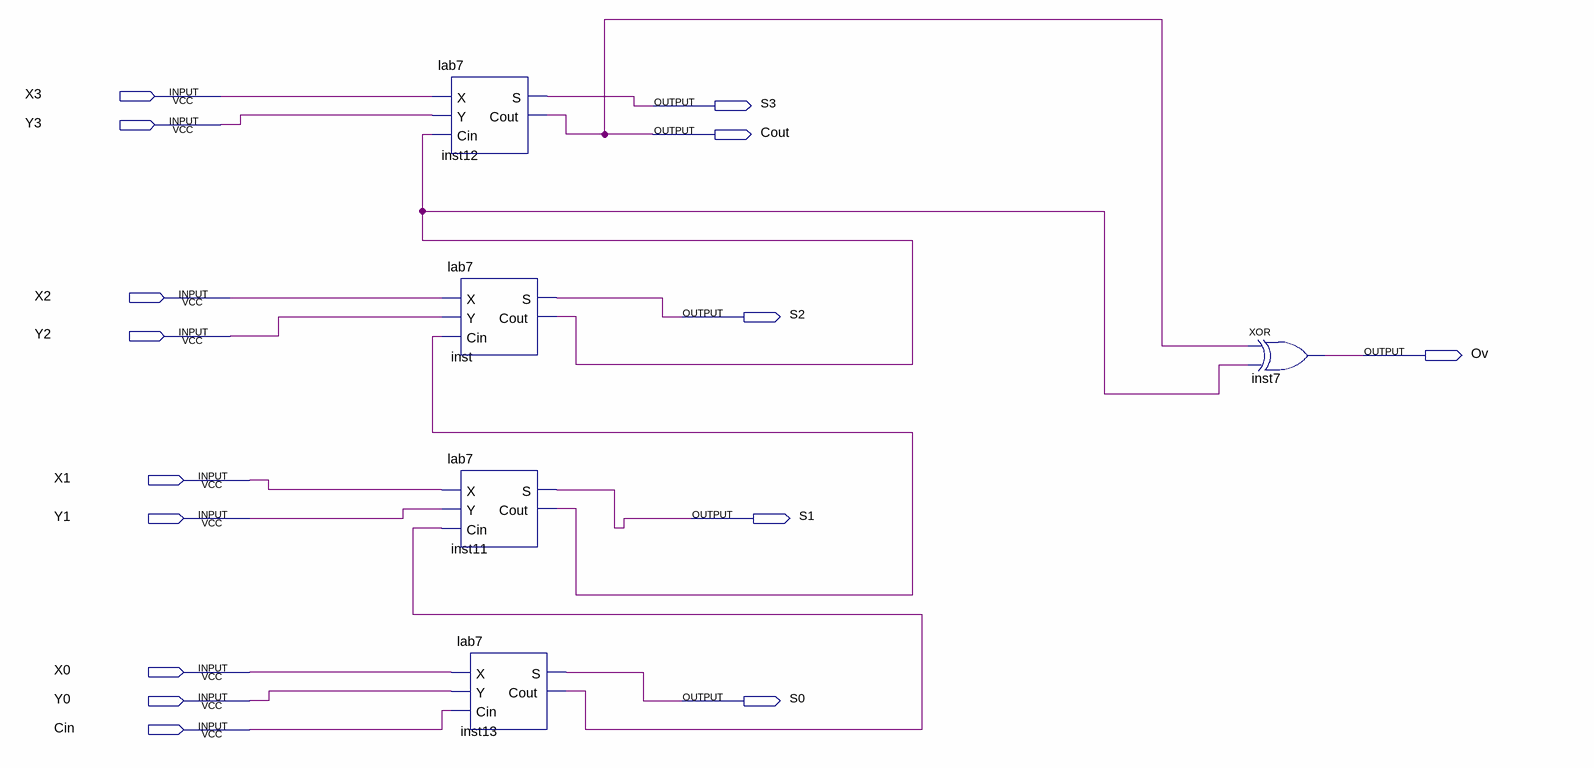
[diagram p0: schematic sheet]
// Quartus schematic bitRippleCarryAdder.bdf as structural Verilog: 5 symbols, 15 pins
module bitRippleCarryAdder (
  input  X3,
  input  Y3,
  input  X2,
  input  Y2,
  input  X1,
  input  Y1,
  input  X0,
  input  Y0,
  input  Cin,
  output S3,
  output Cout,
  output S2,
  output Ov,
  output S1,
  output S0
);

  wire inst11_cout, inst13_cout, inst_cout;

  lab7 inst12 (.X(X3), .Y(Y3), .Cin(inst_cout), .S(S3), .Cout(Cout));
  lab7 inst (.X(X2), .Y(Y2), .Cin(inst11_cout), .S(S2), .Cout(inst_cout));
  lab7 inst11 (.X(X1), .Y(Y1), .Cin(inst13_cout), .S(S1), .Cout(inst11_cout));
  lab7 inst13 (.X(X0), .Y(Y0), .Cin(Cin), .S(S0), .Cout(inst13_cout));
  xor inst7 (Ov, Cout, inst_cout);
endmodule
